# Altium schematic sheet Solar Power Converter with MPPT.SchDoc: PV Boost Converter with MPPT
size Letter; SheetNumber: 10
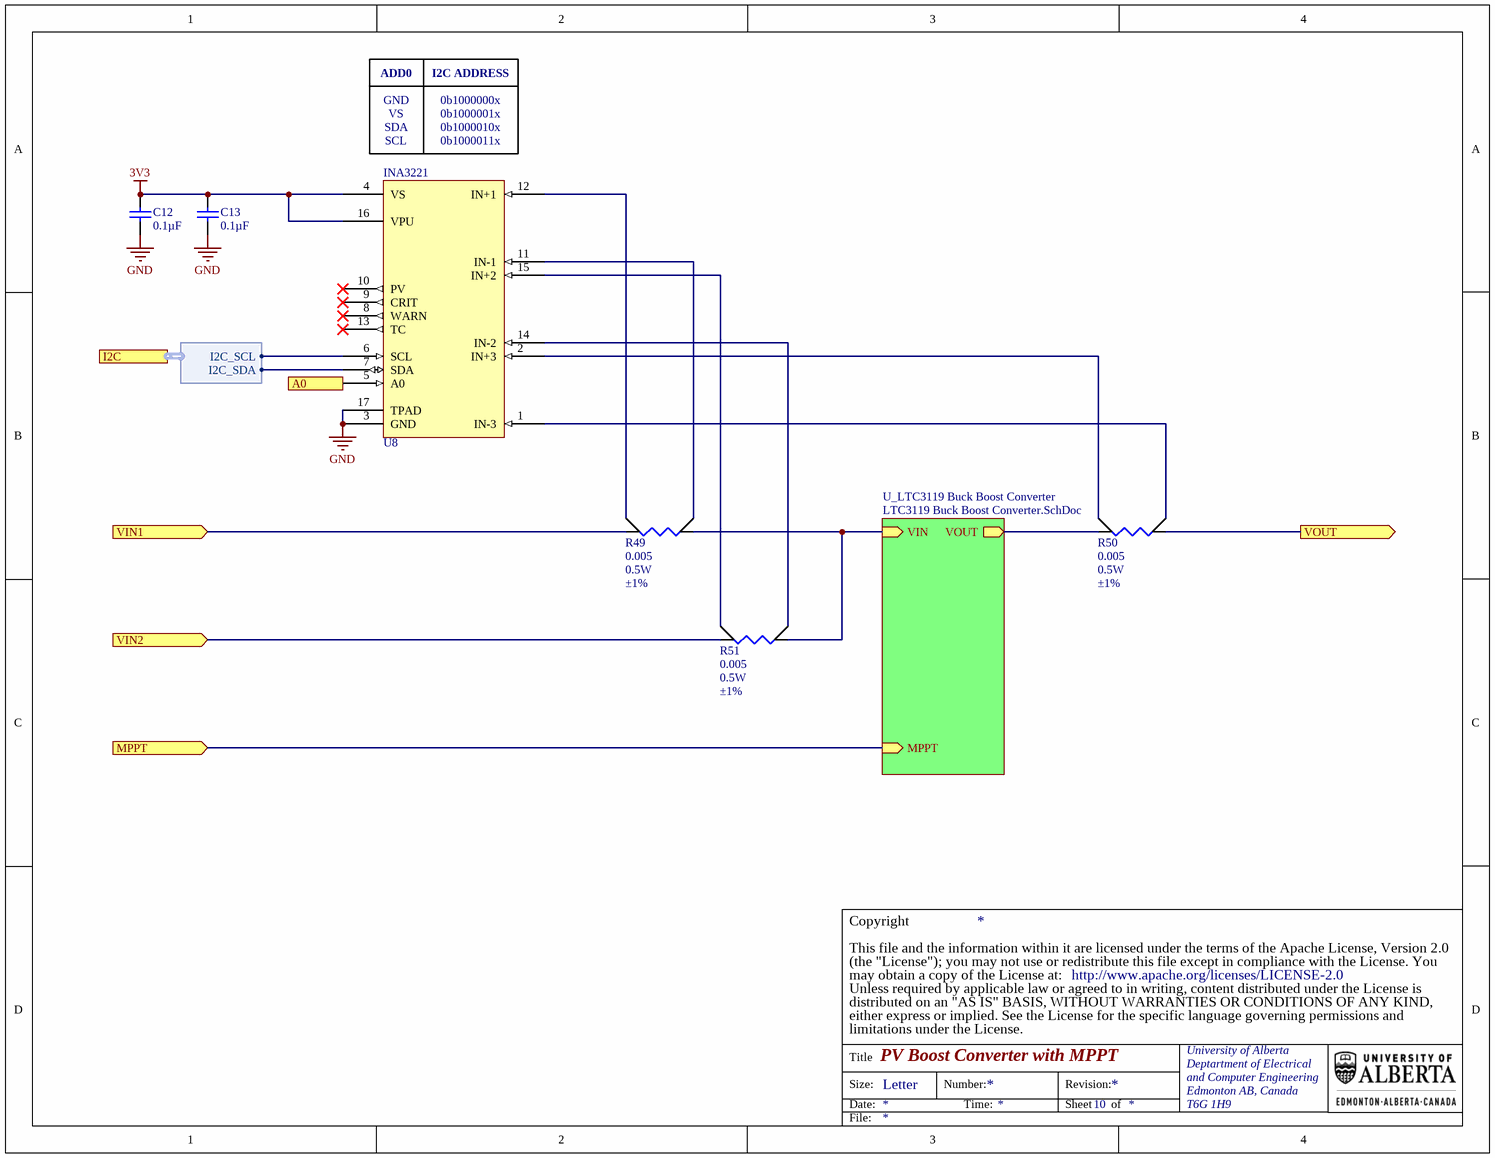
[diagram p0: Solar Power Converter with MPPT.SchDoc]

## Parts
C12  value 0.1µF  [TDK-CGA2B]  (hidden comment: Cap)
C13  value 0.1µF  [TDK-CGA2B]  (hidden comment: Cap)
R49  value 0.005  Power - Rated: 0.5W  Tolerance: ±1%  [BRN-CRF0805]  (hidden comment: Res Sense)
R50  value 0.005  Power - Rated: 0.5W  Tolerance: ±1%  [BRN-CRF0805]  (hidden comment: Res Sense)
R51  value 0.005  Power - Rated: 0.5W  Tolerance: ±1%  [BRN-CRF0805]  (hidden comment: Res Sense)
U8  INA3221  [TI-RGV]

## Sub-sheets
U_LTC3119 Buck Boost Converter = LTC3119 Buck Boost Converter.SchDoc: MPPT (in), VIN (in), VOUT (out)

## Ports
A0 (in), I2C (harness INA3221_I2C), MPPT (in), VIN1 (in), VIN2 (in), VOUT (out)

## Harnesses
INA3221_I2C: I2C_SCL, I2C_SDA

## Nets
3V3: C12.2 C13.2 U8.4(VS) U8.16(VPU)
GND: C12.1 C13.1 U8.3(GND) U8.17(TPAD)
A0: U8.5(A0) ; port A0
MPPT: port MPPT, sheet U_LTC3119 Buck Boost Converter/MPPT
VIN1: R49.2(I2) ; port VIN1
VIN2: R51.2(I2) ; port VIN2
VOUT: R50.1(I1) ; port VOUT
NetR49_1: R49.1(I1) R51.1(I1) ; sheet U_LTC3119 Buck Boost Converter/VIN
NetR49_3: R49.3(S2) U8.12(IN+1)
NetR49_4: R49.4(S1) U8.11(IN-1)
NetR50_2: R50.2(I2) ; sheet U_LTC3119 Buck Boost Converter/VOUT
NetR50_3: R50.3(S2) U8.2(IN+3)
NetR50_4: R50.4(S1) U8.1(IN-3)
NetR51_3: R51.3(S2) U8.15(IN+2)
NetR51_4: R51.4(S1) U8.14(IN-2)
NetU8_6: U8.6(SCL) ; port I2C.I2C_SCL
NetU8_7: U8.7(SDA) ; port I2C.I2C_SDA

Not connected (* = marked no-connect by the designer): U8 8(WARN)* 9(CRIT)* 10(PV)* 13(TC)*

## Notes on the sheet
- ADD0
- GND
- I2C ADDRESS
- 0b1000000x
- VS
- SDA
- (near U8) SCL
- 0b1000001x
- 0b1000010x
- (near U8) 0b1000011x
- (the "License"); you may not use or redistribute this file except in compliance with the License. You
- This file and the information within it are licensed under the terms of the Apache License, Version 2.0
- Copyright
- Unless required by applicable law or agreed to in writing, content distributed under the License is
- distributed on an "AS IS" BASIS, WITHOUT WARRANTIES OR CONDITIONS OF ANY KIND,
- either express or implied. See the License for the specific language governing permissions and
- limitations under the License.
- may obtain a copy of the License at:
- http://www.apache.org/licenses/LICENSE-2.0
- Title
- Size:
- Date:
- Letter
- Number:
- Time:
- Revision:
- Sheet
- of
- University of Alberta
- Deptartment of Electrical
- and Computer Engineering
- Edmonton AB, Canada
- T6G 1H9
- File:

## Library data of the parts
C12 C13 = PC-TDK-02259: CAP CER 0.1UF 50V X7R 0402; Manufacturer Part Number: CGA2B3X7R1H104K050BB; Index: 2259; Designator: C?; Tolerance: ±10%; Published: 2016-03-16; LatestRevisionDate: 2016-03-16; LatestRevisionNote: ...; PackageReference: 0402 (1005 Metric); Publisher: AlbertaSat; PackageDescription: Radial Cap, Thru-Hole; 2 Leads; 0.3 in Pin Spacing; Part Number: PC-TDK-02259; Supplier Part Number 1: 445-6899-1-ND; Supplier 1: Digi-key; Supplier Link: http://www.digikey.ca/product-search/en?keywords=445-6899-1-ND; Voltage - Rated: 50V; Temperature Coefficient: X7R; Applications: Automotive; Operating Temperature: -55°C ~ 125°C
R49-R51 = PR-BRN-00023: RES 0.005 OHM 1% 1/2W 0805; Manufacturer Part Number: CRF0805-FZ-R005ELF; Index: 23; Designator: R?; Temperature Coefficient: ±50ppm/°C; Part Number: PR-BRN-00023; Supplier Part Number 1: CRF0805-FZ-R005ELFCT-ND; Supplier 1: Digi-key; Supplier Part Number 2: 652-CRF0805FZR005ELF; Supplier 2: Mouser; Publisher: AlbertaSat; Published: 2022-11-26; LatestRevisionDate: 2023-05-04; LatestRevisionNote: Added operating temperature; PackageReference: BRN-CRF0805; Supplier Link: #https://www.digikey.ca/en/products/detail/bourns-inc/CRF0805-FZ-R005ELF/6210977#; Operating Temperature: -55°C ~ 170°C
U8 = 39: IC CURRENT SHUNT MONITOR 16VQFN; Part Number: 39; Manufacturer Part Number: INA3221AQRGVRQ1; Designator: U?; Supplier Part Number 1: 296-INA3221AQRGVRQ1CT-ND; Supplier 1: Digi-Key; Supplier Link: #https://www.digikey.ca/en/products/detail/texas-instruments/INA3221AQRGVRQ1/5995432#; PackageReference: TI-VQFN16; Operating Temperature: -40°C ~ 125°C